# EAGLE board AZR3350 (EAGLE 9.3.0), part 1 of 2
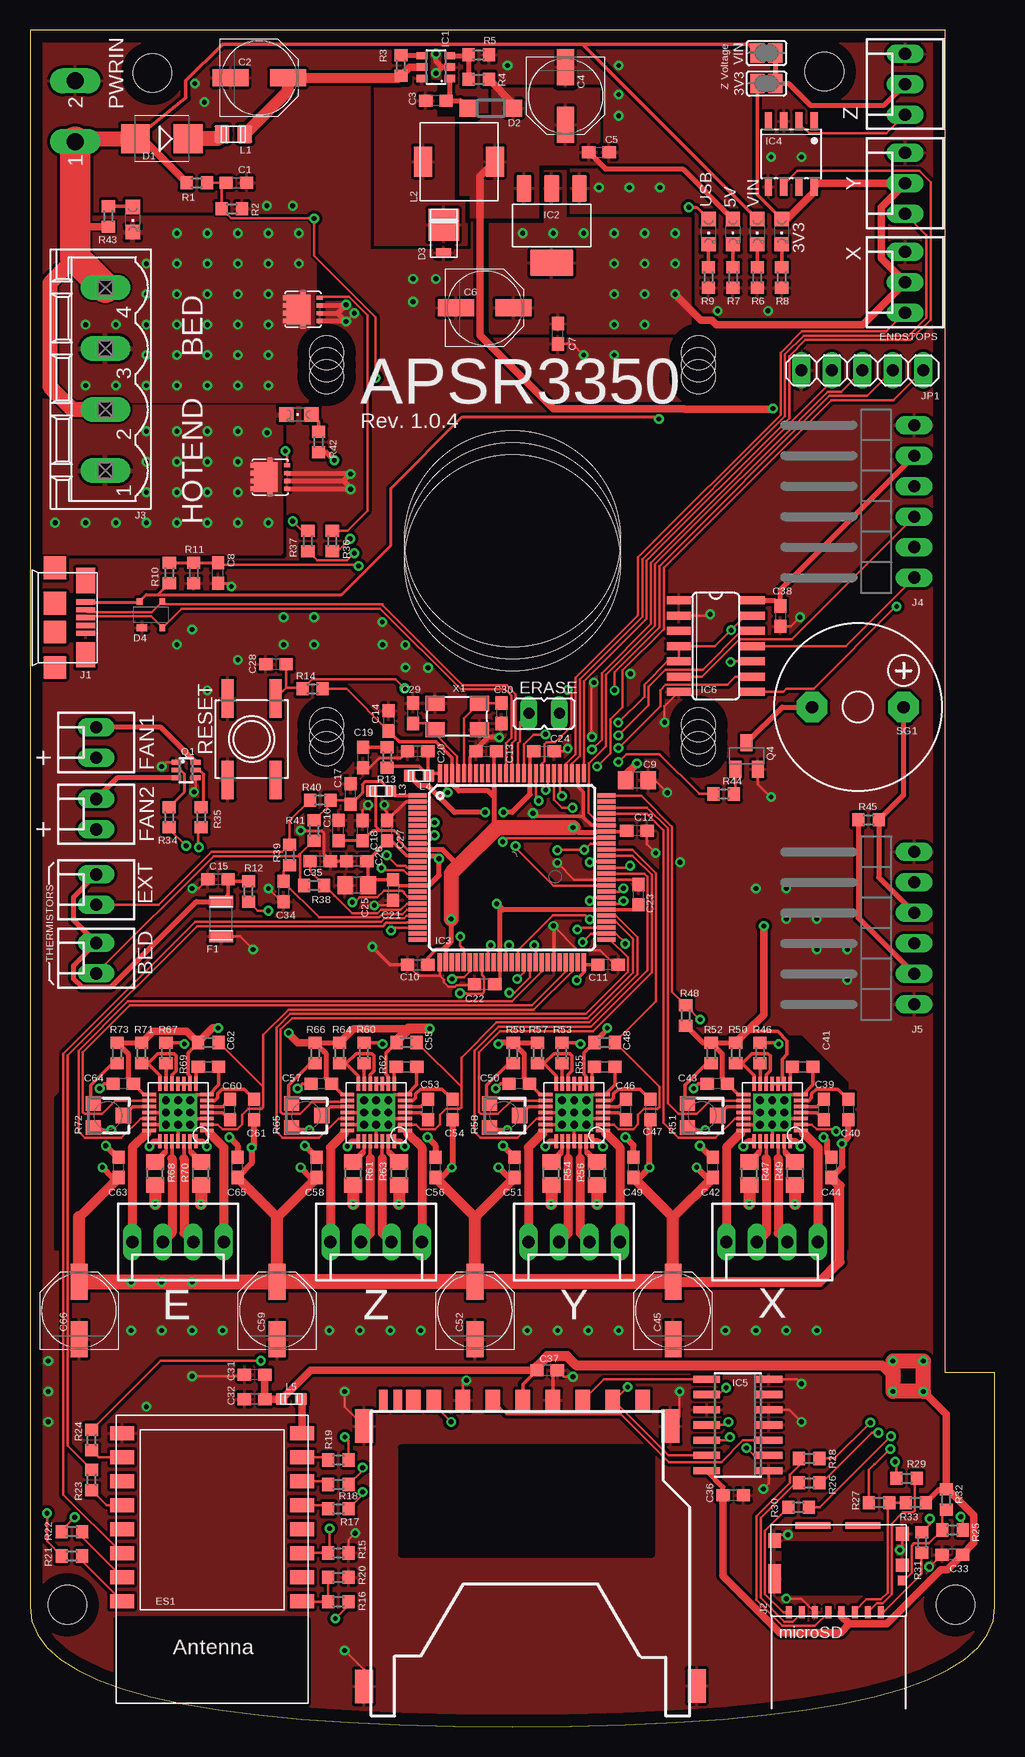
[diagram p6: board, top side]
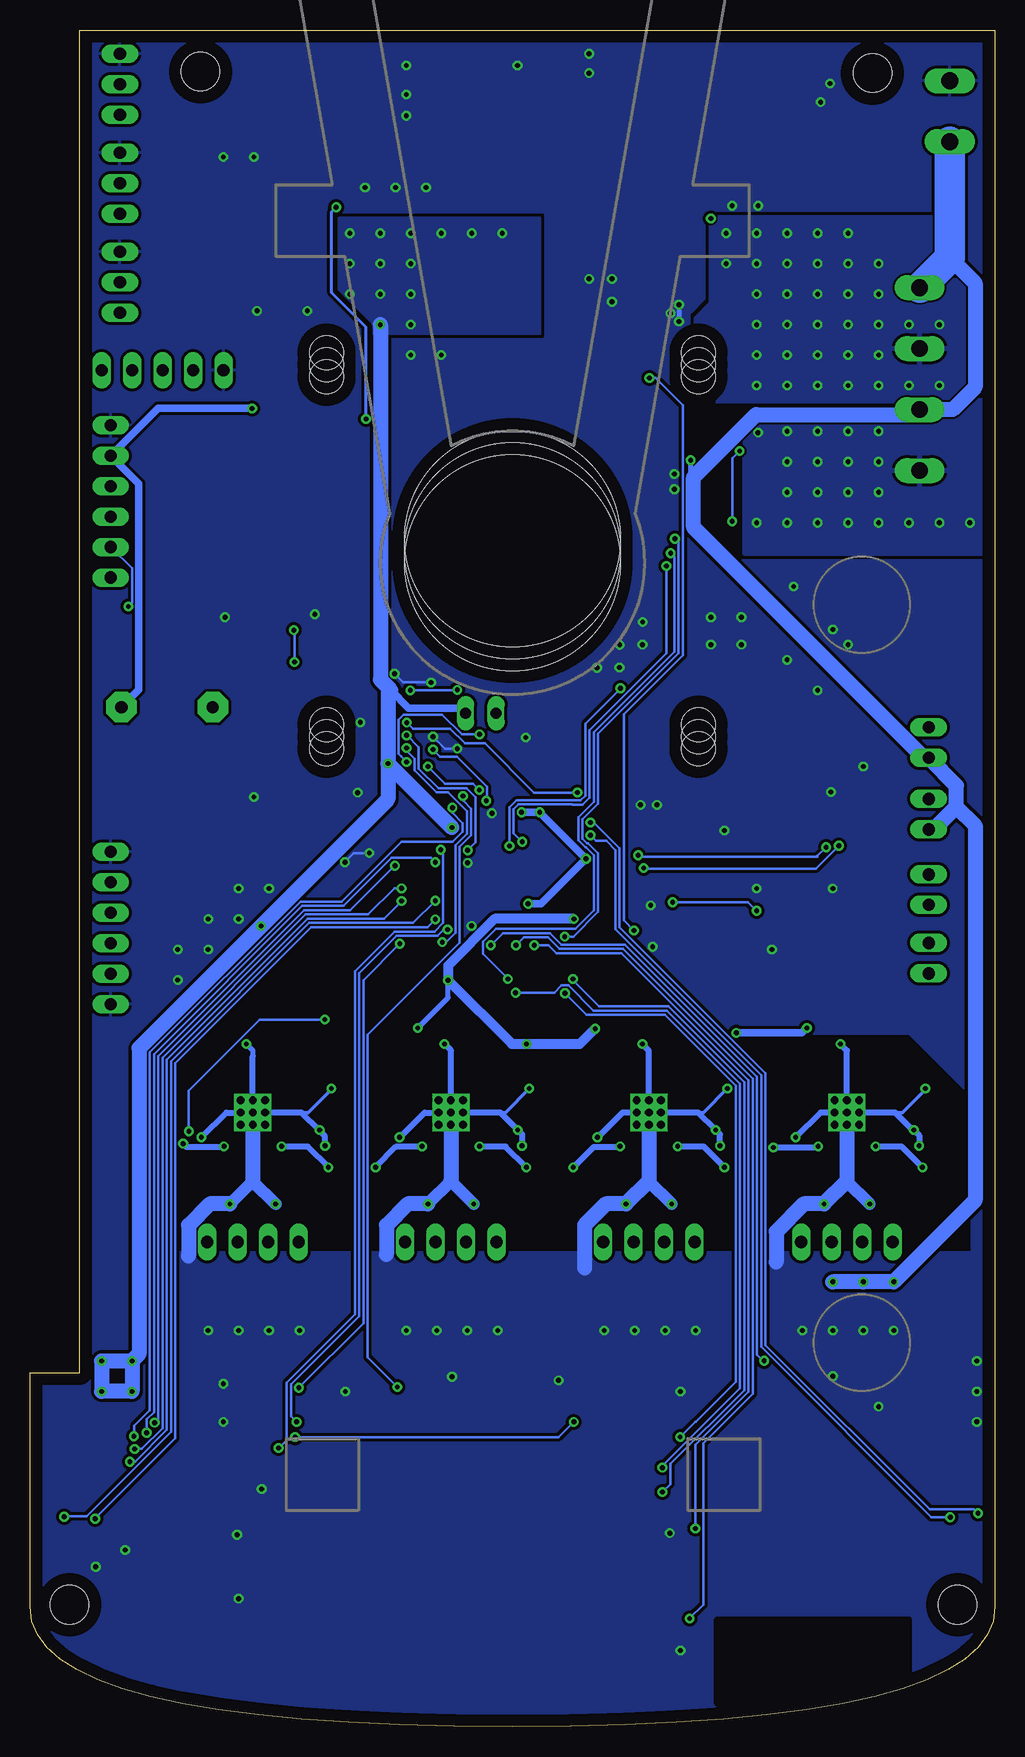
[diagram p7: board, bottom side, seen from below]

Size 80.46 x 141.39 mm. Coordinates in mm from the lower left corner, seen from the top.
Outline: 0,141.39 0,10 0.16,8.79 0.63,7.66 1.41,6.6 2.51,5.62 3.93,4.73 5.66,3.91 7.7,3.16 10.06,2.5 12.73,1.91 15.71,1.41 19.01,0.98 22.63,0.62 26.56,0.35 30.8,0.16 35.36,0.04 40.23,0 45.1,0.04 49.66,0.16 53.9,0.35 57.83,0.62 61.44,0.98 64.74,1.41 67.73,1.91 70.4,2.5 72.76,3.16 74.8,3.91 76.53,4.73 77.94,5.62 79.04,6.6 79.83,7.66 80.3,8.79 80.46,10 80.46,29.5 76.32,29.5 76.32,141.39 0,141.39
Copper layers (1*16): Top 0.035mm / dielectric 1.5mm / Bottom 0.035mm
Design rules "default *": minimum track width 6mil, minimum drill 0.4mm, track to track 6mil, track to pad 6mil, pad to pad 6mil, via to via 10mil, smd to smd 6mil, copper to edge 40mil, drill to drill 6mil, minimum pad ring 10mil, minimum via ring 8mil, stop-mask expansion 4mil, vias tented up to drill 16mil, thermal gap 10mil
Net classes: 1 USB: width 0.102 mm, drill 0.1 mm; 2 gnd: width 0.102 mm, drill 0.1 mm; 3 usbvcc: width 0.102 mm, drill 0.1 mm, clearance 0.15 mm; 4 diff: width 0.203 mm
Holes 2.8 mm at 55.73,81.5 24.73,81.5 24.73,112.5 55.73,112.5 55.73,82.5 24.73,82.5 24.73,113.5 55.73,113.5 55.73,83.5 24.73,83.5 24.73,114.5 55.73,114.5
Holes 18 mm at 40.23,97 40.23,98 40.23,99
Holes 3.2 mm at 77.15,10.16 10.22,137.79 3.11,10.16 66.23,137.92
tKeepout: area 63.2,134.9 to 69.2,140.9; area 74.2,7.2 to 80.2,13.2; area 0.1,7.2 to 6.1,13.2; area 7.2,134.8 to 13.2,140.8

## Footprints (pad centres in the part's own frame; a part is rotated, then mirrored left to right if it is on the bottom)
CHIPLED_0805 = smd 1.2 x 1.2: A 0,-1.05; C 0,1.05
MOLEX-KK-254-2 = drill 1.02 long: 1 -1.27,0; 2 1.27,0
C0603 = smd 1.1 x 1: 1 -0.85,0; 2 0.85,0
PANASONIC_D = smd 3 x 1.4: + 2.4,0; - -2.4,0
C0805 = smd 1.3 x 1.5: 1 -0.95,0; 2 0.95,0
SMB = smd 2.4 x 2.4: A 2.2,0; C -2.2,0
SOD123 = smd 1.4 x 1.4: A 1.9,0; C -1.9,0
DO220AAL = smd 2.667 x 2.54: P$1 -0.7,0 | smd 0.762 x 1.27: P$2 1.65,0
SOT143B = smd 0.88 x 0.55: 1 -0.75,-1.1 | smd 0.48 x 0.55: 2 0.95,-1.1; 3 0.95,1.1; 4 -0.95,1.1
MOLEX-KK-254-4 = drill 1.02 long: 1 -3.81,0; 2 -1.27,0; 3 1.27,0; 4 3.81,0
JP1 = drill 0.914 long: 1 0,-1.27; 2 0,1.27
ESP-12 = smd 2 x 1.2: 1 -7.5,4.5; 2 -7.5,2.5; 3 -7.5,0.5; 4 -7.5,-1.5; 5 -7.5,-3.5; 6 -7.5,-5.5; 7 -7.5,-7.5; 8 -7.5,-9.5; 9 7.5,-9.5; 10 7.5,-7.5; 11 7.5,-5.5; 12 7.5,-3.5; 13 7.5,-1.5; 14 7.5,0.5; 15 7.5,2.5; 16 7.5,4.5
MC36207 = smd 1 x 2: 1 -1.45,0; 2 1.45,0
SOT23-6 = smd 0.6 x 0.9: 1 -0.95,-1.15; 2 0,-1.15; 3 0.95,-1.15; 4 0.95,1.15; 5 0,1.15; 6 -0.95,1.15
SOT223 = smd 2.235 x 1.219: 1 -3.099,2.311; 2 -3.099,0; 3 -3.099,-2.311 | smd 2.2 x 3.6: 4 3.099,0
LQFP100 = smd 1.5 x 0.35: 1 -7.875,6; 2 -7.875,5.5; 3 -7.875,5; 4 -7.875,4.5; 5 -7.875,4; 6 -7.875,3.5; 7 -7.875,3; 8 -7.875,2.5; 9 -7.875,2; 10 -7.875,1.5; 11 -7.875,1; 12 -7.875,0.5; 13 -7.875,0; 14 -7.875,-0.5; 15 -7.875,-1; 16 -7.875,-1.5; 17 -7.875,-2; 18 -7.875,-2.5; 19 -7.875,-3; 20 -7.875,-3.5; 21 -7.875,-4; 22 -7.875,-4.5; 23 -7.875,-5; 24 -7.875,-5.5; 25 -7.875,-6; 51 7.875,-6; 52 7.875,-5.5; 53 7.875,-5; 54 7.875,-4.5; 55 7.875,-4; 56 7.875,-3.5; 57 7.875,-3; 58 7.875,-2.5; 59 7.875,-2; 60 7.875,-1.5; 61 7.875,-1; 62 7.875,-0.5; 63 7.875,0; 64 7.875,0.5; 65 7.875,1; 66 7.875,1.5; 67 7.875,2; 68 7.875,2.5; 69 7.875,3; 70 7.875,3.5; 71 7.875,4; 72 7.875,4.5; 73 7.875,5; 74 7.875,5.5; 75 7.875,6 | smd 0.35 x 1.5: 26 -6.025,-7.875; 27 -5.525,-7.875; 28 -5.025,-7.875; 29 -4.525,-7.875; 30 -4.025,-7.875; 31 -3.525,-7.875; 32 -3.025,-7.875; 33 -2.525,-7.875; 34 -2.025,-7.875; 35 -1.525,-7.875; 36 -1.025,-7.875; 37 -0.525,-7.875; 38 -0.025,-7.875; 39 0.475,-7.875; 40 0.975,-7.875; 41 1.475,-7.875; 42 1.975,-7.875; 43 2.475,-7.875; 44 2.975,-7.875; 45 3.475,-7.875; 46 3.975,-7.875; 47 4.475,-7.875; 48 4.975,-7.875; 49 5.475,-7.875; 50 5.975,-7.875; 76 6,7.875; 77 5.5,7.875; 78 5,7.875; 79 4.5,7.875; 80 4,7.875; 81 3.5,7.875; 82 3,7.875; 83 2.5,7.875; 84 2,7.875; 85 1.5,7.875; 86 1,7.875; 87 0.5,7.875; 88 0,7.875; 89 -0.5,7.875; 90 -1,7.875; 91 -1.5,7.875; 92 -2,7.875; 93 -2.5,7.875; 94 -3,7.875; 95 -3.5,7.875; 96 -4,7.875; 97 -4.5,7.875; 98 -5,7.875; 99 -5.5,7.875; 100 -6,7.875
SOIC08-FAIRCHILD = smd 0.61 x 1.52: 1 -1.905,-2.723; 2 -0.635,-2.723; 3 0.635,-2.723; 4 1.905,-2.723; 5 1.905,2.723; 6 0.635,2.723; 7 -0.635,2.723; 8 -1.905,2.723
SO14 = smd 0.6 x 2.2: 1 -3.81,-2.6; 2 -2.54,-2.6; 3 -1.27,-2.6; 4 0,-2.6; 5 1.27,-2.6; 6 2.54,-2.6; 7 3.81,-2.6; 8 3.81,2.6; 9 2.54,2.6; 10 1.27,2.6; 11 0,2.6; 12 -1.27,2.6; 13 -2.54,2.6; 14 -3.81,2.6
SO14' = smd 0.66 x 2.032: 1 -3.81,-3.073; 2 -2.54,-3.073; 3 -1.27,-3.073; 4 0,-3.073; 5 1.27,-3.073; 6 2.54,-3.073; 7 3.81,-3.073; 8 3.81,3.073; 9 2.54,3.073; 10 1.27,3.073; 11 0,3.073; 12 -1.27,3.073; 13 -2.54,3.073; 14 -3.81,3.073
QFN28-TP = smd 1.15 x 0.3: 1 -2.4,1.5; 2 -2.4,1; 3 -2.4,0.5; 4 -2.4,0; 5 -2.4,-0.5; 6 -2.4,-1; 7 -2.4,-1.5; 15 2.4,-1.5; 16 2.4,-1; 17 2.4,-0.5; 18 2.4,0; 19 2.4,0.5; 20 2.4,1; 21 2.4,1.5 | smd 0.3 x 1.15: 8 -1.5,-2.4; 9 -1,-2.4; 10 -0.5,-2.4; 11 0,-2.4; 12 0.5,-2.4; 13 1,-2.4; 14 1.5,-2.4; 22 1.5,2.4; 23 1,2.4; 24 0.5,2.4; 25 0,2.4; 26 -0.5,2.4; 27 -1,2.4; 28 -1.5,2.4 | smd 3.15 x 3.15: PAD 0,0
USB-MICRO-10103594 = smd 0.4 x 1.6: D+ 0,0; D- -0.65,0; GND 1.3,0; ID 0.65,0; VBUS -1.3,0 | smd 1.9 x 1.9: SHLD1 -1.2,-2.55; SHLD2 1.2,-2.55; SHLD3 -4.15,-2.55; SHLD4 4.15,-2.55 | smd 2.1 x 1.6: SHLD5 3.1,0; SHLD6 -3.1,0
MOLEX-105162 = smd 1.05 x 1.08: G1 5.325,4.45 | smd 1.05 x 1.2: G2 5.325,7.06; G3 -5.325,6.49 | smd 1.05 x 2.39: G4 -5.325,3.305 | smd 0.5 x 1: P1 3.55,0.5; P2 2.45,0.5; P3 1.35,0.5; P4 0.25,0.5; P5 -0.85,0.5; P6 -1.95,0.5; P7 -3.05,0.5; P8 -4.15,0.5 | smd 0.72 x 0.78: P9 5.31,3.18 | smd 2.91 x 0.55: X1 -2.145,7.735; X2 2.045,7.735
MSTBV4 = drill 1.397 long: 1 -7.62,0; 2 -2.54,0; 3 2.54,0; 4 7.62,0
1X06/90 = drill 1.016 long: 1 -6.35,-3.81; 2 -3.81,-3.81; 3 -1.27,-3.81; 4 1.27,-3.81; 5 3.81,-3.81; 6 6.35,-3.81
1X05 = drill 1.016 long: 1 -5.08,0; 2 -2.54,0; 3 0,0; 4 2.54,0; 5 5.08,0
C0805' = smd 1.5 x 1.25: 1 0,0.95; 2 0,-0.95
SRR0604 = smd 1.5 x 2.5: P$1 3,0; P$2 -3,0
C0603' = smd 1 x 0.95: 1 0,0.8; 2 0,-0.8
2-PIN-508 = drill 1.397 long: 1 -2.54,5.08; 2 2.54,5.08
SOT363_PHILIPS = smd 0.4 x 0.8: 1 -0.65,-0.8; 2 0,-0.8; 3 0.65,-0.8; 4 0.65,0.8; 5 0,0.8; 6 -0.65,0.8
3X3DFN-EP = smd 0.35 x 0.5: 1 -0.975,-1.4; 2 -0.325,-1.4; 3 0.325,-1.4; 4 0.975,-1.4 | smd 0.4 x 0.3: 5 0.975,1.5; 6 0.325,1.5; 7 -0.325,1.5; 8 -0.975,1.5 | smd 0.38 x 0.43: E1 -1.415,0; E2 1.415,0 | smd 2.45 x 1.98: PAD 0,0.36
SOT23-BEC = smd 1 x 1.4: B -0.95,-1.1; C 0,1.1; E 0.95,-1.1
R0603 = smd 1 x 1.1: 1 -0.85,0; 2 0.85,0
R0805 = smd 1.3 x 1.5: 1 -0.95,0; 2 0.95,0
RTRIM3103 = smd 1.2 x 1.25: 1 -1,-1.225; 3 1,-1.225 | smd 1.3 x 1.3: 2 0,1.3
EVQQ2 = smd 3.2 x 1: A -3.4,2; A' 3.4,2; B -3.4,-2; B' 3.4,-2
F/CM12P = drill 1.016 pad 2.54 octagon: + 3.81,0; - -3.81,0
SJ = smd 1.168 x 1.6: 1 -0.762,0; 2 0.762,0
5.0X3.2_KX-9A = smd 1.6 x 1.25: 1 -1.85,-1.1; 2 1.85,-1.1; 3 1.85,1.1; 4 -1.85,1.1
2041021 = smd 1.2 x 1.8: 1 7,2.8; 2 4.5,2.8; 3 2,2.8; 4 -0.5,2.8; 5 -3,2.8; 6 -5.5,2.8; 7 -7.93,2.8; 8 -9.63,2.8; 9 9.5,2.8 | smd 0.7 x 1.8: CD -10.93,2.8; WP -12.13,2.8 | smd 1.5 x 2.8: G1 11.809,0.666; G2 14.009,-20.984; G3 -13.741,-21.034; G4 -13.741,0.666
MOLEX-KK-254-3 = drill 1.02 long: 1 -2.54,0; 2 0,0; 3 2.54,0

## Placement (x,y rotation side)
3V3  [CHIPLED_0805]  62.67,124.59 180 top
5V  [CHIPLED_0805]  58.61,124.59 180 top
BED  KK-254-2  [MOLEX-KK-254-2]  5.53,64.04 90 top
BED_L  [CHIPLED_0805]  8.57,125.6 180 top
C1  10n  [C0603]  17.2,128.65 0 top
C2  10uF  [PANASONIC_D]  19.11,137.41 0 top
C3  100n  [C0603]  33.85,135.51 180 top
C4  47u  [PANASONIC_D]  44.64,135.89 270 top
C5  4.7uF  [C0603]  47.44,131.19 0 top
C6  10uF  [PANASONIC_D]  37.91,118.24 0 top
C7  4.7uF  [C0603]  44.01,116.08 90 top
C8  100n  [C0603]  15.68,96.14 90 top
C9  10u  [C0805]  50.6,78.87 180 top
C10  100n  [C0603]  32.32,63.5 0 top
C11  100n  [C0603]  48.19,63.5 180 top
C12  100n  [C0603]  50.61,74.68 180 top
C13  100n  [C0603]  38.04,81.28 0 top
C14  100n  [C0603]  29.9,83.82 270 top
C15  2.2u  [C0603]  15.68,70.61 180 top
C16  100n  [C0603]  25.72,74.68 90 top
C17  100n  [C0603]  26.73,77.73 90 top
C18  10u  [C0603]  27.75,74.67 90 top
C19  4u7  [C0603]  27.75,80.77 270 top
C20  100n  [C0603]  32.32,81.28 180 top
C21  100n  [C0603]  30.29,69.72 270 top
C22  100n  [C0603]  37.91,61.85 180 top
C23  100n  [C0603]  50.74,69.34 90 top
C24  100n  [C0603]  42.86,81.28 0 top
C25  10u  [C0805]  27.24,70.11 180 top
C26  100n  [C0603]  27.24,72.13 180 top
C27  2.2u 0.1-10ohm ESR  [C0603]  29.78,74.67 90 top
C28  10n  [C0603]  20.51,88.52 180 top
C29  10p  [C0603]  31.94,84.45 90 top
C30  10p  [C0603]  39.31,84.45 270 top
C31  10u  [C0603]  18.73,29.33 180 top
C32  10u  [C0603]  18.73,27.3 180 top
C33  2K2  [C0603]  76.9,14.35 180 top
C34  2.2u  [C0603]  21.14,69.6 270 top
C35  2.2u  [C0603]  24.2,72.14 0 top
C36  2.2u  [C0603]  58.64,19.31 0 top
C37  1u  [C0603]  43.11,29.72 0 top
C38  100n  [C0603]  62.55,92.55 270 top
C39  100n  [C0603]  66.2,51.44 90 top
C40  100n  [C0603]  68.23,51.44 270 top
C41  220n  [C0603]  64.42,54.99 0 top
C42  100n  [C0603]  56.93,46.61 90 top
C43  220n  [C0603]  57.31,53.59 180 top
C44  100n  [C0603]  66.83,46.61 90 top
C45  100u  [PANASONIC_D]  53.62,34.67 90 top
C46  100n  [C0603]  49.69,51.44 90 top
C47  100n  [C0603]  51.72,51.44 270 top
C48  220n  [C0603]  47.91,54.99 0 top
C49  100n  [C0603]  50.32,46.61 90 top
C50  220n  [C0603]  40.8,53.59 180 top
C51  100n  [C0603]  40.42,46.61 90 top
C52  100u  [PANASONIC_D]  37.11,34.67 90 top
C53  100n  [C0603]  33.18,51.44 90 top
C54  100n  [C0603]  35.21,51.44 270 top
C55  220n  [C0603]  31.4,54.99 0 top
C56  100n  [C0603]  33.81,46.61 90 top
C57  220n  [C0603]  24.29,53.59 180 top
C58  100n  [C0603]  23.91,46.61 90 top
C59  100u  [PANASONIC_D]  20.6,34.67 90 top
C60  100n  [C0603]  16.67,51.44 90 top
C61  100n  [C0603]  18.7,51.44 270 top
C62  220n  [C0603]  14.89,54.99 0 top
C63  100n  [C0603]  7.4,46.61 90 top
C64  220n  [C0603]  7.78,53.59 180 top
C65  100n  [C0603]  17.3,46.61 90 top
C66  100u  [PANASONIC_D]  4.09,34.67 90 top
D1  BYS10-45-E3  [SMB]  10.99,132.33 180 top
D2  CD1206-S01575  [SOD123]  38.42,134.87 0 top
D3  SS1P3L  [DO220AAL]  34.49,124.46 270 top
D4  PRTR5V0U2XB  [SOT143B]  10.1,92.68 0 top
E  KK-254-4  [MOLEX-KK-254-4]  12.35,40.39 180 top
ERASE  [JP1]  42.86,84.45 90 top
ES1  [ESP-12]  15.17,14.95 180 top
EXT  KK-254-2  [MOLEX-KK-254-2]  5.53,69.75 90 top
EXT_L  [CHIPLED_0805]  22.41,109.34 90 top
F1  MC36207  [MC36207]  15.93,67.31 270 top
FAN1  KK-254-2  [MOLEX-KK-254-2]  5.53,82.01 90 top
FAN2  KK-254-2  [MOLEX-KK-254-2]  5.53,76.04 90 top
IC1  LM2734Y  [SOT23-6]  33.85,138.3 90 top
IC2  LDO-TS1117CW-3V3  [SOT223]  43.5,125.09 270 top
IC3  ATSAM4S8C  [LQFP100]  40.19,71.59 0 top
IC4  SI87XXIS  [SOIC08-FAIRCHILD]  63.47,131.06 180 top
IC5  74HC125  [SO14]  59.02,25.15 90 top
IC6  74S08D  [SO14']  57.18,90.05 270 top
IC7  A4988  [QFN28-TP]  61.88,51.18 180 top
IC8  A4988  [QFN28-TP]  45.37,51.18 180 top
IC9  A4988  [QFN28-TP]  28.86,51.18 180 top
IC10  A4988  [QFN28-TP]  12.35,51.18 180 top
J1  ZX62-AB-5PA  [USB-MICRO-10103594]  4.64,92.42 270 top
J2  MOLEX-105162-001  [MOLEX-105162]  67.4,9.02 0 top
J3  MSTBV4  [MSTBV4]  6.28,112.3 90 top
J4  [1X06/90]  69.91,102.11 90 top
J5  [1X06/90]  69.91,66.55 90 top
JP1  [1X05]  69.4,113.03 180 top
L1  MH2029-300Y  [C0805']  16.96,132.72 90 top
L2  10uH-SRR0604-100ML  [SRR0604]  35.75,130.43 180 top
L3  10uH 100MHz  [C0603']  29.27,77.97 270 top
L4  10uH 100MHz  [C0603']  32.44,79.25 270 top
L5  4n7H  [C0603']  21.78,27.3 90 top
PWRIN  2-PIN-508  [2-PIN-508]  8.85,134.62 90 top
Q1  NX138BKS  [SOT363_PHILIPS]  13.01,79.72 270 top
Q2  AON7524  [3X3DFN-EP]  20.03,104.14 90 top
Q3  AON7524  [3X3DFN-EP]  22.76,118.11 90 top
Q4  BC817-16SMD  [SOT23-BEC]  59.75,80.9 0 top
R1  47K  [R0603]  13.91,128.65 180 top
R2  4K7  [R0603]  16.83,126.49 180 top
R3  100k  [R0603]  30.93,138.43 90 top
R4  5.53k  [R0603]  37.4,137.28 180 top
R5  10k  [R0603]  37.4,139.32 0 top
R6  4K7  [R0603]  60.64,120.78 270 top
R7  2K2  [R0603]  58.61,120.78 270 top
R8  180R  [R0603]  62.67,120.78 270 top
R9  2K2  [R0603]  56.57,120.78 270 top
R10  27K  [R0603]  11.62,96.14 90 top
R11  47K  [R0603]  13.65,96.14 270 top
R12  10K  [R0603]  18.22,69.6 90 top
R13  1R  [R0603]  29.78,80.77 270 top
R14  10K  [R0603]  23.56,86.49 0 top
R15  4K7  [R0603]  25.72,14.47 0 top
R16  470R  [R0603]  25.72,10.41 180 top
R17  47R  [R0603]  25.72,18.16 0 top
R18  47R  [R0603]  25.72,20.19 0 top
R19  47R  [R0603]  25.72,22.22 0 top
R20  2K2  [R0603]  25.72,12.44 180 top
R21  2K2  [R0603]  3.49,14.22 0 top
R22  470R  [R0603]  3.49,16.25 0 top
R23  2K2  [R0603]  5.14,20.57 270 top
R24  2K2  [R0603]  5.14,23.88 270 top
R25  220R  [R0603]  76.9,16.38 180 top
R26  220R  [R0603]  64.96,20.32 180 top
R27  220R  [R0603]  70.8,18.67 0 top
R28  100R  [R0603]  64.96,22.36 180 top
R29  220R  [R0603]  73.09,20.7 0 top
R30  220R  [R0603]  64.07,18.29 180 top
R31  220R  [R0603]  74.36,15.36 270 top
R32  10K  [R0603]  76.39,18.93 90 top
R33  10K  [R0603]  73.85,18.67 0 top
R34  1K  [R0603]  11.62,75.79 90 top
R35  1K  [R0603]  14.28,75.79 90 top
R36  180R  [R0603]  23.17,98.81 90 top
R37  180R  [R0603]  25.2,98.81 90 top
R38  10K  [R0603]  23.69,70.1 180 top
R39  10K  [R0603]  21.66,72.64 90 top
R40  4K7 0.1%  [R0603]  24.19,77.21 0 top
R41  4K7 0.1%  [R0603]  23.69,74.68 90 top
R42  4K7  [R0603]  24.06,107.06 270 top
R43  4K7  [R0603]  6.54,125.86 270 top
R44  1K  [R0603]  57.85,77.73 0 top
R45  47R  [R0603]  69.91,75.57 180 top
R46  10K  [R0603]  60.86,56.13 90 top
R47  0R2  [R0805]  59.97,46.1 90 top
R48  10K  [R0603]  54.67,59.28 270 top
R49  0R2  [R0805]  63.78,46.1 90 top
R50  100K  [R0603]  58.83,56.13 90 top
R51  10K  [RTRIM3103]  56.04,50.93 270 top
R52  20K  [R0603]  56.8,56.13 90 top
R53  10K  [R0603]  44.35,56.13 90 top
R54  0R2  [R0805]  43.46,46.1 90 top
R55  10K  [R0603]  47.91,57.02 180 top
R56  0R2  [R0805]  47.27,46.1 90 top
R57  100K  [R0603]  42.32,56.13 90 top
R58  10K  [RTRIM3103]  39.53,50.93 270 top
R59  20K  [R0603]  40.29,56.13 90 top
R60  10K  [R0603]  27.84,56.13 90 top
R61  0R2  [R0805]  26.95,46.1 90 top
R62  10K  [R0603]  31.4,57.02 180 top
R63  0R2  [R0805]  30.76,46.1 90 top
R64  100K  [R0603]  25.81,56.13 90 top
R65  10K  [RTRIM3103]  23.02,50.93 270 top
R66  20K  [R0603]  23.78,56.13 90 top
R67  10K  [R0603]  11.33,56.13 90 top
R68  0R2  [R0805]  10.44,46.1 90 top
R69  10K  [R0603]  14.89,57.02 180 top
R70  0R2  [R0805]  14.25,46.1 90 top
R71  100K  [R0603]  9.3,56.13 90 top
R72  10K  [RTRIM3103]  6.51,50.93 270 top
R73  20K  [R0603]  7.27,56.13 90 top
RESET  [EVQQ2]  18.48,82.3 270 top
SG1  F/CM12P  [F/CM12P]  69.03,84.96 0 top
SJ1  [SJ]  61.4,136.94 0 top
SJ2  [SJ]  61.4,139.47 0 top
USB  [CHIPLED_0805]  56.57,124.59 180 top
VIN  [CHIPLED_0805]  60.64,124.59 180 top
X  KK-254-4  [MOLEX-KK-254-4]  61.88,40.39 180 top
X1  12MHz  [5.0X3.2_KX-9A]  35.62,84.2 180 top
X2  [2041021]  41.59,24.38 0 top
X_STOP  KK-254-3  [MOLEX-KK-254-3]  72.96,120.37 90 top
Y  KK-254-4  [MOLEX-KK-254-4]  45.37,40.39 180 top
Y_STOP  KK-254-3  [MOLEX-KK-254-3]  72.96,128.62 90 top
Z  KK-254-4  [MOLEX-KK-254-4]  28.86,40.39 180 top
Z_STOP  KK-254-3  [MOLEX-KK-254-3]  72.96,136.88 90 top